# EAGLE design PiBladeBackPlane-V1 (EAGLE 7.4.0)

## Sheet 1 of 2
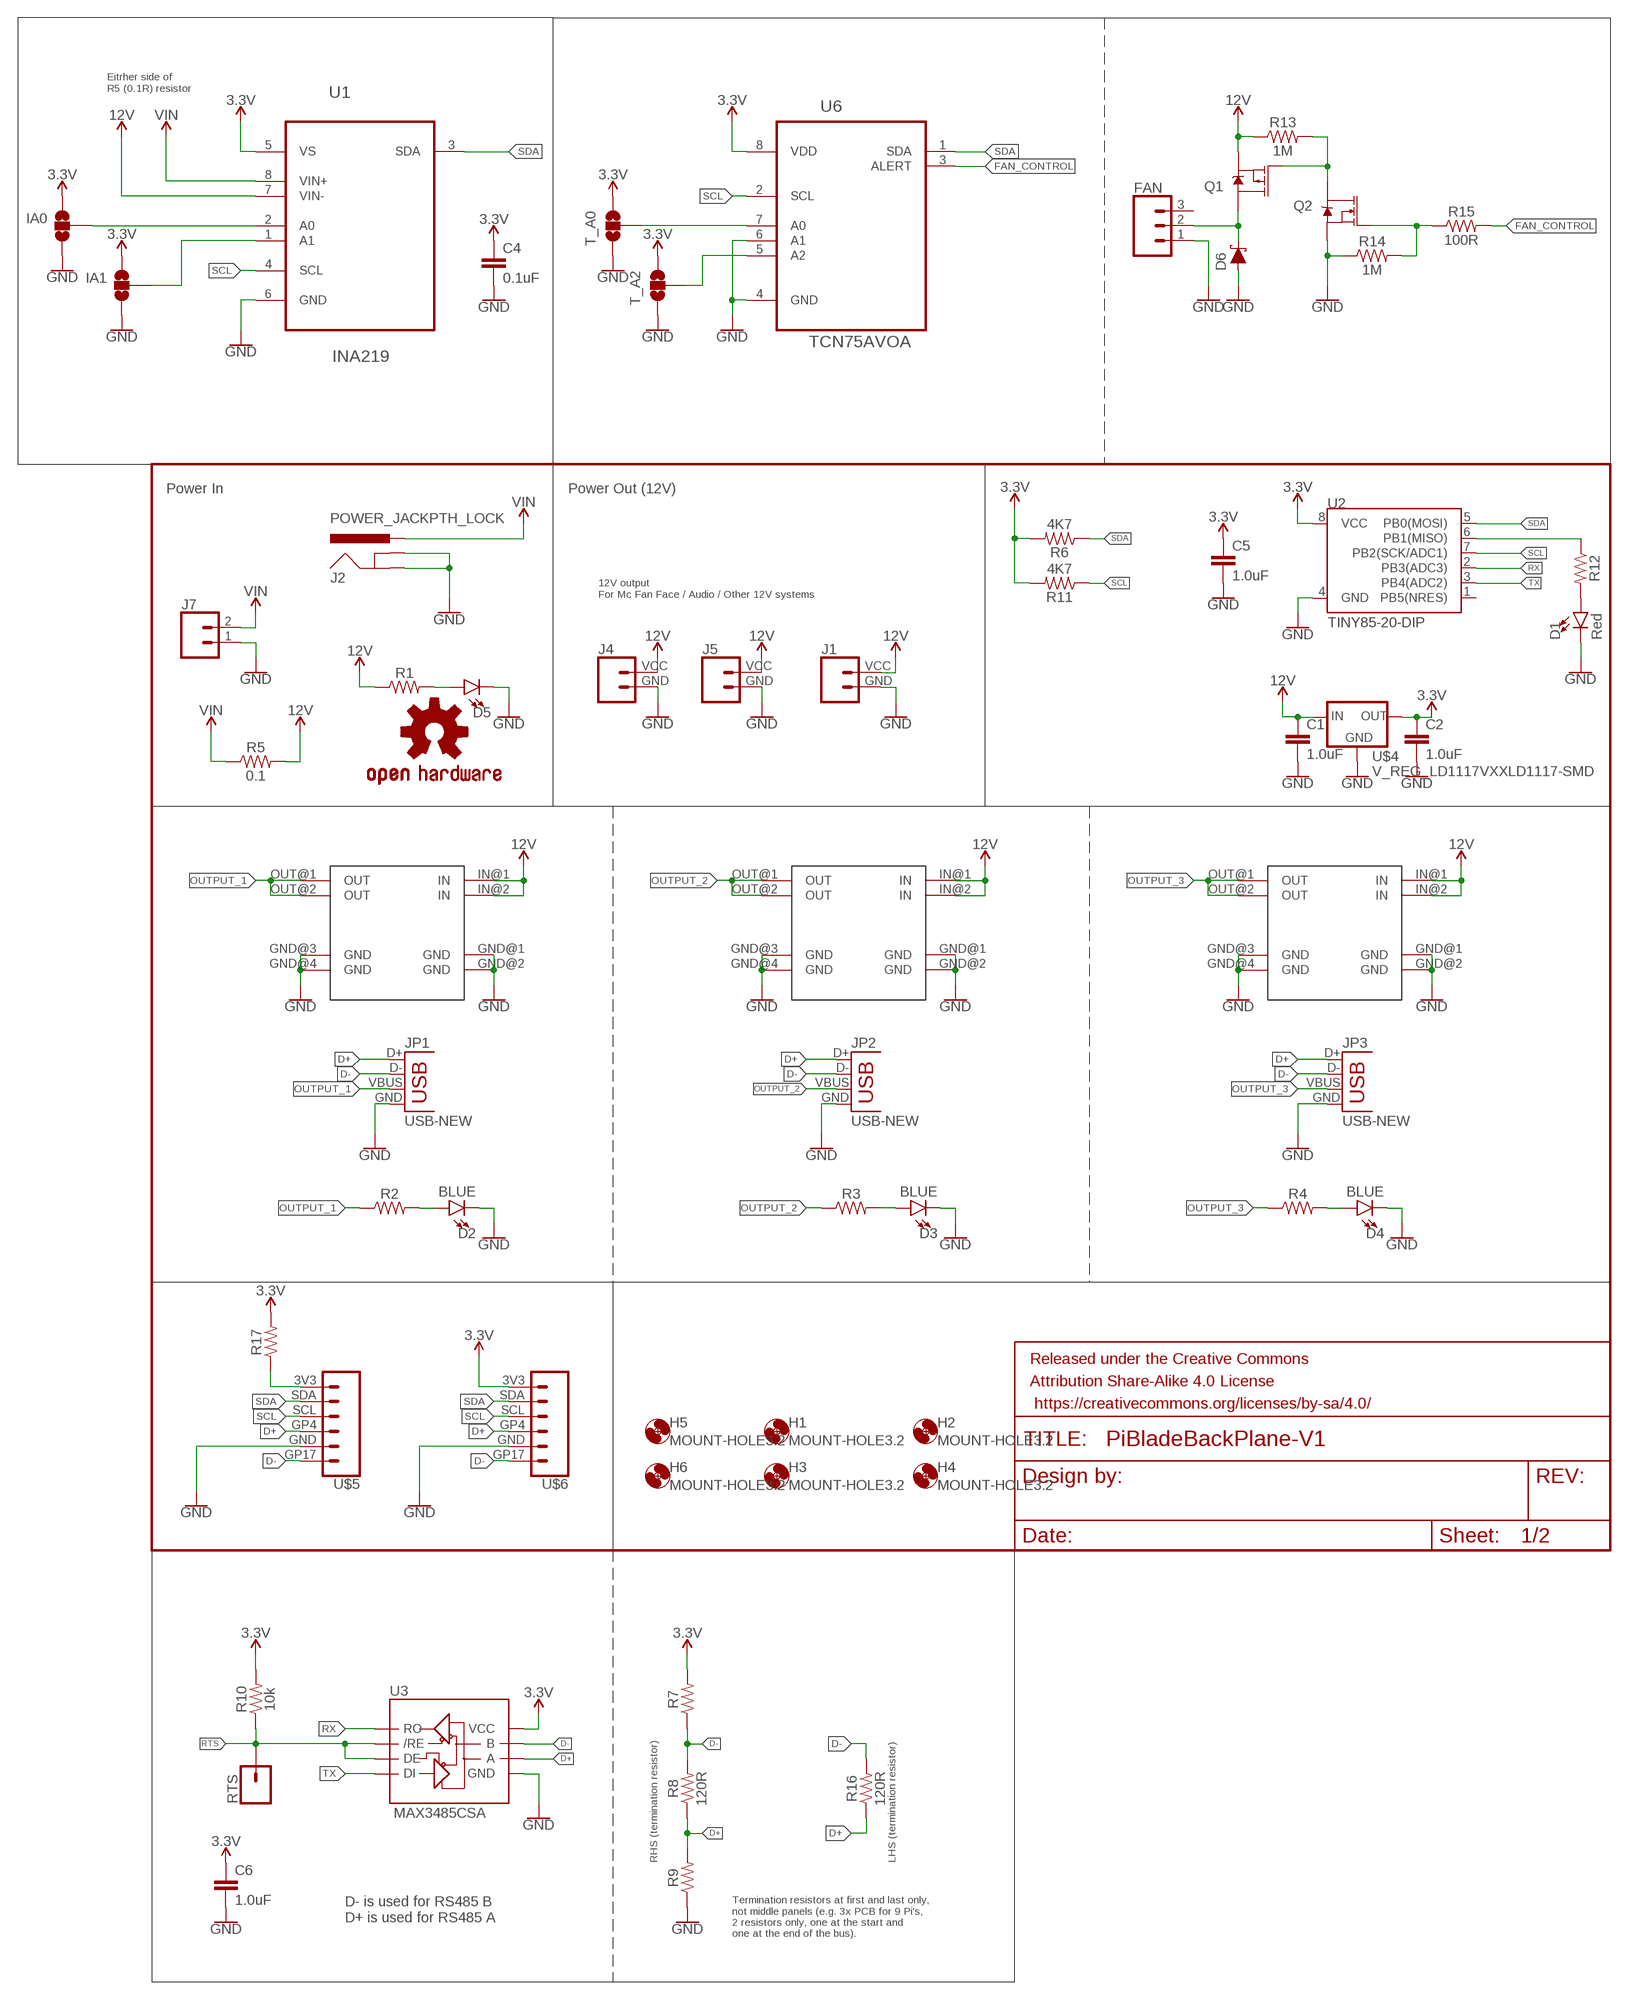
[diagram p0: schematic, sheet 1]

### Parts
C1  1.0uF  1.0UF-0805-25V-(+80/-20%)  [0805]
C2  1.0uF  1.0UF-0805-25V-(+80/-20%)  [0805]
C4  0.1uF  1.0UF-0805-25V-(+80/-20%)  [0805]
C5  1.0uF  1.0UF-0805-25V-(+80/-20%)  [0805]
C6  1.0uF  1.0UF-0805-25V-(+80/-20%)  [0805]
D1  Red  LED-BLUE1206  [LED-1206]
D2  BLUE  LED-BLUE1206  [LED-1206]
D3  BLUE  LED-BLUE1206  [LED-1206]
D4  BLUE  LED-BLUE1206  [LED-1206]
D5  LED1206-BOTTOM  [LED-1206-BOTTOM]
D6  1A/23V/620mV  DIODE-SCHOTTKY-BAT20J  [SOD-323]
FAN  CONN_03POLAR  [MOLEX-1X3]
FRAME1  FRAME-LETTER  [CREATIVE_COMMONS]
H1  MOUNT-HOLE3.2  [3,2]
H2  MOUNT-HOLE3.2  [3,2]
H3  MOUNT-HOLE3.2  [3,2]
H4  MOUNT-HOLE3.2  [3,2]
H5  MOUNT-HOLE3.2  [3,2]
H6  MOUNT-HOLE3.2  [3,2]
IA0  JUMPER-SMT_3_NO_NO_SILK  [SMT-JUMPER_3_0-NO_TRACE_NO-SILK]
IA1  JUMPER-SMT_3_NO_NO_SILK  [SMT-JUMPER_3_0-NO_TRACE_NO-SILK]
J1  CONN_02JST-2-PH-VERT  [JST-2-SMD-VERT]
J2  POWER_JACKPTH_LOCK  [POWER_JACK_PTH_LOCK]
J4  CONN_02JST-2-PH-VERT  [JST-2-SMD-VERT]
J5  CONN_02JST-2-PH-VERT  [JST-2-SMD-VERT]
J7  CONN_025MM  [SCREWTERMINAL-5MM-2]
JP1  USB-NEW  [USB-A-VERTICAL]
JP2  USB-NEW  [USB-A-VERTICAL]
JP3  USB-NEW  [USB-A-VERTICAL]
LOGO1  OSHW-LOGOM  [OSHW-LOGO-M]
Q1  4.3A/20V/54mΩ  MOSFET_PCH-IRLML2244  [SOT23-3]
Q2  310mA/60V/1.6Ω  MOSFET-NCH-2N7002PW  [SOT323]
R1  RESISTOR0805  [0805]
R2  RESISTOR0805  [0805]
R3  RESISTOR0805  [0805]
R4  RESISTOR0805  [0805]
R5  0.1  0.1OHM-1210-1/2W-1%  [1210]
R6  4K7  RESISTOR0805  [0805]
R7  RESISTOR0805  [0805]
R8  120R  RESISTOR0805  [0805]
R9  RESISTOR0805  [0805]
R10  10k  RESISTOR0805  [0805]
R11  4K7  RESISTOR0805  [0805]
R12  RESISTOR0805  [0805]
R13  1M  RESISTOR0805  [0805]
R14  1M  RESISTOR0805  [0805]
R15  100R  RESISTOR0805  [0805]
R16  120R  RESISTOR0805  [0805]
R17  RESISTOR1206  [1206]
RTS  CONN_01  [1X01]
T_A0  JUMPER-SMT_3_NO_NO_SILK  [SMT-JUMPER_3_0-NO_TRACE_NO-SILK]
T_A2  JUMPER-SMT_3_NO_NO_SILK  [SMT-JUMPER_3_0-NO_TRACE_NO-SILK]
U1  INA219  INA219AIDCNRSOIC  [SO08]
U2  TINY85-20-DIP  ATTINY45TINY85-20-DIP  [DIP08_MCU]
U3  MAX3485CSA  RS485SOIC  [SO08]
U6  TCN75AVOA  [SOIC127P600X175-8N]
U$1  MINI-BUCK-MODULE-3A  [MINI-BUCK-MODULE-3A]
U$2  MINI-BUCK-MODULE-3A  [MINI-BUCK-MODULE-3A]
U$3  MINI-BUCK-MODULE-3A  [MINI-BUCK-MODULE-3A]
U$4  V_REG_LD1117VXXLD1117-SMD  [SOT223]
U$5  MC_PI_FACE_CONNECTORS_I2CTOP  [JST-6-SH-1.0MM-TOP]
U$6  MC_PI_FACE_CONNECTORS_I2CTOP  [JST-6-SH-1.0MM-TOP]

### Nets
3.3V: C2.1 C4.1 C5.1 C6.1 IA0.1 IA1.1 R6.2 R7.2 R10.2 R11.2 R17.2 T_A0.1 T_A2.1 U1.5(VS) U2.8(VCC) U3.8(VCC) U6.8(VDD) U$4.2(OUT) U$6.3V3
12V: C1.1 J1.VCC J4.VCC J5.VCC Q1.2(S) R1.1 R5.2 R13.1 U1.7(VIN-) U$1.IN@1(IN) U$1.IN@2(IN) U$2.IN@1(IN) U$2.IN@2(IN) U$3.IN@1(IN) U$3.IN@2(IN) U$4.3(IN)
A0: IA0.2 U1.2(A0)
A1: IA1.2 U1.1(A1)
D+: JP1.D+ JP2.D+ JP3.D+ R8.1 R9.2 R16.1 U3.6(A) U$5.GP4 U$6.GP4
D-: JP1.D- JP2.D- JP3.D- R7.1 R8.2 R16.2 U3.7(B) U$5.GP17 U$6.GP17
FAN_CONTROL: R15.2 U6.3(ALERT)
GND: C1.2 C2.2 C4.2 C5.2 C6.2 D1.C D2.C D3.C D4.C D5.C D6.A FAN.1 IA0.3 IA1.3 J1.GND J2.GND J2.GNDBREAK J4.GND J5.GND J7.1 JP1.GND JP2.GND JP3.GND Q2.2(S) R9.1 R14.1 T_A0.3 T_A2.3 U1.6(GND) U2.4(GND) U3.5(GND) U6.4(GND) U6.6(A1) U$1.GND@1(GND) U$1.GND@2(GND) U$1.GND@3(GND) U$1.GND@4(GND) U$2.GND@1(GND) U$2.GND@2(GND) U$2.GND@3(GND) U$2.GND@4(GND) U$3.GND@1(GND) U$3.GND@2(GND) U$3.GND@3(GND) U$3.GND@4(GND) U$4.1(GND) U$5.GND U$6.GND
N$1: D5.A R1.2
N$3: D4.A R4.2
N$4: D2.A R2.2
N$6: D1.A R12.2
N$7: D3.A R3.2
N$8: R12.1 U2.6(PB1(MISO))
N$9: Q1.1(G) Q2.3(D) R13.2
N$10: D6.C FAN.2 Q1.3(D)
N$11: T_A0.2 U6.7(A0)
N$12: T_A2.2 U6.5(A2)
N$18: Q2.1(G) R14.2 R15.1
N$25: R17.1 U$5.3V3
OUTPUT_1: JP1.VBUS R2.1 U$1.OUT@1(OUT) U$1.OUT@2(OUT)
OUTPUT_2: JP2.VBUS R3.1 U$2.OUT@1(OUT) U$2.OUT@2(OUT)
OUTPUT_3: JP3.VBUS R4.1 U$3.OUT@1(OUT) U$3.OUT@2(OUT)
RTS: R10.1 RTS.1 U3.2(/RE) U3.3(DE)
RX: U2.2(PB3(ADC3)) U3.1(RO)
SCL: R11.1 U1.4(SCL) U2.7(PB2(SCK/ADC1)) U6.2(SCL) U$5.SCL U$6.SCL
SDA: R6.1 U1.3(SDA) U2.5(PB0(MOSI)) U6.1(SDA) U$5.SDA U$6.SDA
TX: U2.3(PB4(ADC2)) U3.4(DI)
VIN: J2.PWR J7.2 R5.1 U1.8(VIN+)
Unconnected: FAN.3 U2.1(PB5(NRES))

### Notes on the sheet
- Eitrher side of 
  R5 (0.1R) resistor
- Power In | Power Out (12V)
- 12V output
  For Mc Fan Face / Audio / Other 12V systems
- RHS (termination resistor) | LHS (termination resistor)
- D- is used for RS485 B
  D+ is used for RS485 A
- Termination resistors at first and last only, 
  not middle panels (e.g. 3x PCB for 9 Pi's, 
  2 resistors only, one at the start and 
  one at the end of the bus).

## Sheet 2 of 2

## Library data of the parts
C1 C2 C5 C6 = SparkFun-Capacitors:1.0UF: 1µF ceramic capacitors A capacitor is a passive two-terminal electrical component used to store electrical energy temporarily in an electric field.; PROD_ID: CAP-11625
C4 = SparkFun-Capacitors:1.0UF: 1µF ceramic capacitors A capacitor is a passive two-terminal electrical component used to store electrical energy temporarily in an electric field.; PROD_ID: CAP-11625; VALUE: 1.0uF
D1 = SparkFun-LED:LED-BLUE: Blue SMD LED Used in manufacturing of various products at SparkFun Packages: 0603 - SMD 0603 package [Product Link] <http://www.digikey.com/product-detail/en/SMLE12BC7TT86/511-1589-2-ND/1641808> 1206 - SMD1206 package [Product Link] <http://www.digikey.com/product-detail/en/lite-on-inc/LTST-C150TBKT/160-1643-1-ND/573584> SparkFun Products: ESP8266 Thing-Dev Board <https://www.sparkfun.com/products/13711> RedBoard <https://www.sparkfun.com/products/12757>; PROD_ID: DIO-09911; VALUE: BLUE
D2-D4 = SparkFun-LED:LED-BLUE: Blue SMD LED Used in manufacturing of various products at SparkFun Packages: 0603 - SMD 0603 package [Product Link] <http://www.digikey.com/product-detail/en/SMLE12BC7TT86/511-1589-2-ND/1641808> 1206 - SMD1206 package [Product Link] <http://www.digikey.com/product-detail/en/lite-on-inc/LTST-C150TBKT/160-1643-1-ND/573584> SparkFun Products: ESP8266 Thing-Dev Board <https://www.sparkfun.com/products/13711> RedBoard <https://www.sparkfun.com/products/12757>; PROD_ID: DIO-09911
D5 = SparkFun-LED:LED: LED (Generic) Standard schematic elements and footprints for 5mm, 3mm, 1206, and 0603 sized LEDs. Generic LEDs with no color specified.
D6 = SparkFun-DiscreteSemi:DIODE-SCHOTTKY: Schottky diode A Schottky diode is a semiconductor diode which has a low forward voltage drop and a very fast switching action.; PROD_ID: DIO-11623
FAN = SparkFun-Connectors:CONN_03: Multi connection point. Often used as Generic Header-pin footprint for 0.1 inch spaced/style header connections On any of the 0.1 inch spaced packages, you can populate with these: Break Away Headers - Straight <https://www.sparkfun.com/products/116> (PRT-00116) Break Away Male Headers - Right Angle <https://www.sparkfun.com/products/553> (PRT-00553) Female Headers <https://www.sparkfun.com/products/115> (PRT-00115) Break Away Headers - Machine Pin <https://www.sparkfun.com/products/117> (PRT-00117) Break Away Female Headers - Swiss Machine Pin <https://www.sparkfun.com/products/743> (PRT-00743) Stackable Header - 3 Pin (Female, 0.1") <https://www.sparkfun.com/products/13875> (PRT-13875) For SCREWTERMINALS and SPRING TERMINALS visit here: Screw Terimnals on SparkFun.com <https://www.sparkfun.com/search/results?term=Screw+Terminals> (5mm/3.5mm/2.54mm spacing) This device is also useful as a general connection point to wire up your design to another part of your project. Our various solder wires solder well into these plated through hole pads. Hook-Up Wire - Assortment (Stranded, 22 AWG) <https://www.sparkfun.com/products/11375> (PRT-11375) Hook-Up Wire - Assortment (Solid Core, 22 AWG) <https://www.sparkfun.com/products/11367> (PRT-11367) View the entire wire category on our website here <https://www.sparkfun.com/categories/141> Special notes: Molex polarized connector foot print use with SKU : PRT-08232 with associated crimp pins and housings.; PROD_ID: CONN-08625; SF_ID: PRT-08096
FRAME1 = SparkFun-Aesthetics:FRAME-LETTER: Schematic Frame - Letter Standard 8.5x11 US Letter frame
H1-H6 = holes:MOUNT-HOLE: MOUNTING HOLE with drill center marker
IA0 IA1 T_A0 T_A2 = SparkFun-Jumpers:JUMPER-SMT_3_NO: Normally open jumper This jumper has three pads in close proximity to each other. Apply solder to close the connection(s).
J1 J4 J5 = ThingySticks:CONN_02: Multi connection point. Often used as Generic Header-pin footprint for 0.1 inch spaced/style header connections On any of the 0.1 inch spaced packages, you can populate with these: Break Away Headers - Straight <https://www.sparkfun.com/products/116> (PRT-00116) Break Away Male Headers - Right Angle <https://www.sparkfun.com/products/553> (PRT-00553) Female Headers <https://www.sparkfun.com/products/115> (PRT-00115) Break Away Headers - Machine Pin <https://www.sparkfun.com/products/117> (PRT-00117) Break Away Female Headers - Swiss Machine Pin <https://www.sparkfun.com/products/743> (PRT-00743) For SCREWTERMINALS and SPRING TERMINALS visit here: Screw Terimnals on SparkFun.com <https://www.sparkfun.com/search/results?term=Screw+Terminals> (5mm/3.5mm/2.54mm spacing) This device is also useful as a general connection point to wire up your design to another part of your project. Our various solder wires solder well into these plated through hole pads. Hook-Up Wire - Assortment (Stranded, 22 AWG) <https://www.sparkfun.com/products/11375> (PRT-11375) Hook-Up Wire - Assortment (Solid Core, 22 AWG) <https://www.sparkfun.com/products/11367> (PRT-11367) View the entire wire category on our website here <https://www.sparkfun.com/categories/141> Special notes: Molex polarized connector foot print use with: PRT-08233 with associated crimp pins and housings. 2.54_SCREWTERM for use with PRT-10571. 3.5mm Screw Terminal footprints for PRT-08084 5mm Screw Terminal footprints for use with PRT-08432
J2 = SparkFun-Connectors:POWER_JACK: Power Jack Connector This is the standard 5.5mm barrel jack for power. The PTH is the most common, proven, reliable, footprint. The Slot footprint only works if the mill layer is transmitted to the PCB fab house so be warned. Here are the connectors we sell at SparkFun: DC Barrel Power Jack/Connector <https://www.sparkfun.com/products/119> (PRT-00119) DC Barrel Power Jack/Connector (SMD) <https://www.sparkfun.com/products/12748> (PRT-12748) DC Barrel Jack Adapter - Breadboard Compatible <https://www.sparkfun.com/products/10811> (PRT-10811) It is used on this SparkFun product (and many, many others): SparkFun RedBoard - Programmed with Arduino <https://www.sparkfun.com/products/12757> (DEV-12757) Also, if you need a mating power supply or connector, please check these out: Wall Adapter Power Supply - 9VDC 650mA <https://www.sparkfun.com/products/298> (TOL-00298) DC Barrel Jack Adapter - Male <https://www.sparkfun.com/products/10287> (PRT-10287); PROD_ID: CONN-08197; SF_ID: PRT-00119
J7 = SparkFun-Connectors:CONN_02: Multi connection point. Often used as Generic Header-pin footprint for 0.1 inch spaced/style header connections On any of the 0.1 inch spaced packages, you can populate with these: Break Away Headers - Straight <https://www.sparkfun.com/products/116> (PRT-00116) Break Away Male Headers - Right Angle <https://www.sparkfun.com/products/553> (PRT-00553) Female Headers <https://www.sparkfun.com/products/115> (PRT-00115) Break Away Headers - Machine Pin <https://www.sparkfun.com/products/117> (PRT-00117) Break Away Female Headers - Swiss Machine Pin <https://www.sparkfun.com/products/743> (PRT-00743) For SCREWTERMINALS and SPRING TERMINALS visit here: Screw Terimnals on SparkFun.com <https://www.sparkfun.com/search/results?term=Screw+Terminals> (5mm/3.5mm/2.54mm spacing) This device is also useful as a general connection point to wire up your design to another part of your project. Our various solder wires solder well into these plated through hole pads. Hook-Up Wire - Assortment (Stranded, 22 AWG) <https://www.sparkfun.com/products/11375> (PRT-11375) Hook-Up Wire - Assortment (Solid Core, 22 AWG) <https://www.sparkfun.com/products/11367> (PRT-11367) View the entire wire category on our website here <https://www.sparkfun.com/categories/141> Special notes: Molex polarized connector foot print use with: PRT-08233 with associated crimp pins and housings. 2.54_SCREWTERM for use with PRT-10571. 3.5mm Screw Terminal footprints for PRT-08084 5mm Screw Terminal footprints for use with PRT-08432; SF_SKU: PRT-08432
JP1-JP3 = Tinamous:USB-NEW: USB Connectors USB-B-PTH is fully proven SKU : PRT-00139/CONN-08278 USB-miniB is fully proven SKU : PRT-00587 USB-A-PCB is untested. USB-A-H is throughly reviewed, but untested. Spark Fun Electronics SKU : PRT-00437 USB-B-SMT is throughly reviewed, but untested. Needs silkscreen touching up. USB-A-S has not been used/tested USB-MB-H has not been used/tested USB-MICROB has been used. CONN-09505
LOGO1 = SparkFun-Aesthetics:OSHW-LOGO: Open-Source Hardware (OSHW) Logo This logo indicates the piece of hardware it is found on incorporates a OSHW license and/or adheres to the definition of open source hardware found here: http://freedomdefined.org/OSHW
Q1 = SparkFun-DiscreteSemi:MOSFET_PCH: P-channel MOSFETs Voltage controlled devices that allow control of high current outputs. SparkFun Products: SparkFun ESP32 Thing <https://www.sparkfun.com/products/13907> SparkFun ESP8266 Thing <https://www.sparkfun.com/products/13231>; PROD_ID: TRANS-11153
Q2 = SparkFun-DiscreteSemi:MOSFET-NCH: N-channel MOSFETs Voltage controlled devices that allow control of high current outputs. SparkFun Products: SparkFun OpenScale <https://www.sparkfun.com/products/13261> SparkFun Digital Sandbox <https://www.sparkfun.com/products/12651> SparkFun Monster Moto Shield <https://www.sparkfun.com/products/10182> SparkFun MOSFET Power Controller <https://www.sparkfun.com/products/11214>; PROD_ID: TRANS-11151
R1-R4 R6-R17 = SparkFun-Resistors:RESISTOR: Generic Resistor Package
R5 = SparkFun-Resistors:0.1OHM: 0.1Ω resistor A resistor is a passive two-terminal electrical component that implements electrical resistance as a circuit element. Resistors act to reduce current flow, and, at the same time, act to lower voltage levels within circuits. - Wikipedia; PROD_ID: RES-12374
RTS = SparkFun-Connectors:CONN_01: Single connection point. Often used as Generic Header-pin footprint for 0.1 inch spaced/style header connections On any of the 0.1 inch spaced packages, you can populate with these: Break Away Headers - Straight <https://www.sparkfun.com/products/116> (PRT-00116) Break Away Male Headers - Right Angle <https://www.sparkfun.com/products/553> (PRT-00553) Female Headers <https://www.sparkfun.com/products/115> (PRT-00115) Break Away Headers - Machine Pin <https://www.sparkfun.com/products/117> (PRT-00117) Break Away Female Headers - Swiss Machine Pin <https://www.sparkfun.com/products/743> (PRT-00743) This device is also useful as a general connection point to wire up your design to another part of your project. Our various solder wires solder well into these plated through hole pads. Hook-Up Wire - Assortment (Stranded, 22 AWG) <https://www.sparkfun.com/products/11375> (PRT-11375) Hook-Up Wire - Assortment (Solid Core, 22 AWG) <https://www.sparkfun.com/products/11367> (PRT-11367) View the entire wire category on our website here <https://www.sparkfun.com/categories/141> Special notes: SMTSO-256-ET is a "flush mount" nut for a 4-40 screw. We mostly use this on specialty testbeds; it is a nice way to connect hardware to your PCB at an adjustable hieght. Also note, the SNAP packages are for using a snappable style connector. We sell a baggie of snaps and they are also used on two LilyPad designs: Snap Assortment - 30 pack (male and female) <https://www.sparkfun.com/products/11347> (DEV-11347) LilyPad Arduino SimpleSnap <https://www.sparkfun.com/products/10941> (DEV-10941) LilyPad SimpleSnap Protoboard <https://www.sparkfun.com/products/10940> (DEV-10940)
U1 = INA219AIDCNR:INA219AIDCNR: CURRENT/POWER MONITOR
U2 = SparkFun-Retired:ATTINY45: Atmel 8-pin 2/4/8kB flash uC Retired; PROD_ID: IC-09445
U3 = SparkFun-IC-Comms:RS485: RS-485 Transceiver SP3485 Series 8 Pin NSOIC 3.3 V Low Power Half Duplex RS-485 Transceiver MAX3485 compatible Datasheet <http://www.sparkfun.com/datasheets/Components/General/sp3485CN-LTR.pdf> SparkFun Products SparkFun Transceiver Breakout - RS-485 <https://www.sparkfun.com/products/10124> (BOB-10124) SparkFun USB to RS-485 Converter <https://www.sparkfun.com/products/9822> (BOB-09822); PROD_ID: IC-09388
U6 = Microchip-TCN75AVOA:TCN75AVOA: 2-Wire Serial Temperature Sensor,SOIC-8; MPN: TCN75AVOA; OC_FARNELL: 1605585; OC_NEWARK: 71J7900; PACKAGE: SOIC-8; SUPPLIER: MICROCHIP
U$1-U$3 = Tinamous:MINI-BUCK-MODULE-3A
U$4 = SparkFun-IC-Power:V_REG_LD1117VXX: LD1117VXX voltage regulator. We carry the 3.3V version (COM-00526) in TO-220 package.; PROD_ID: VREG-13917
U$5 U$6 = McPiFace:MC_PI_FACE_CONNECTORS_I2C

## Board
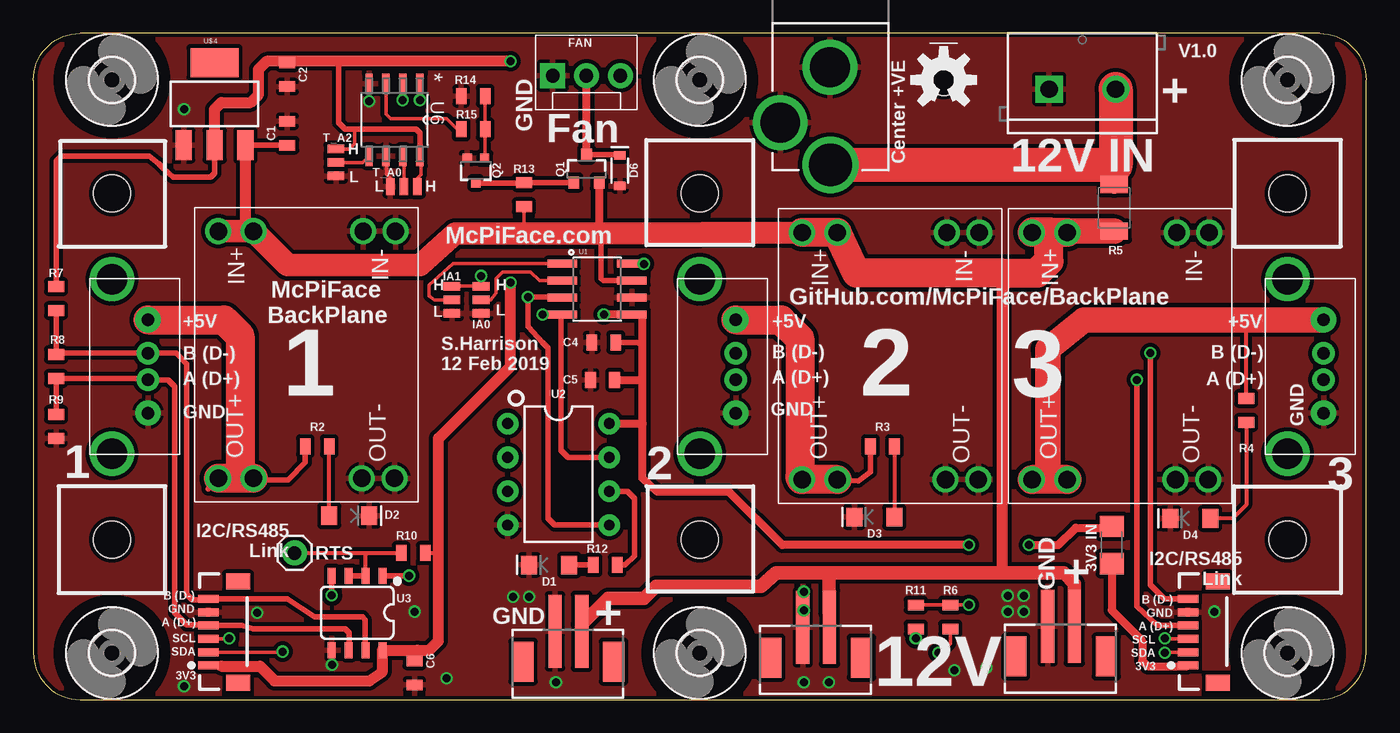
[diagram p1: board, top side]
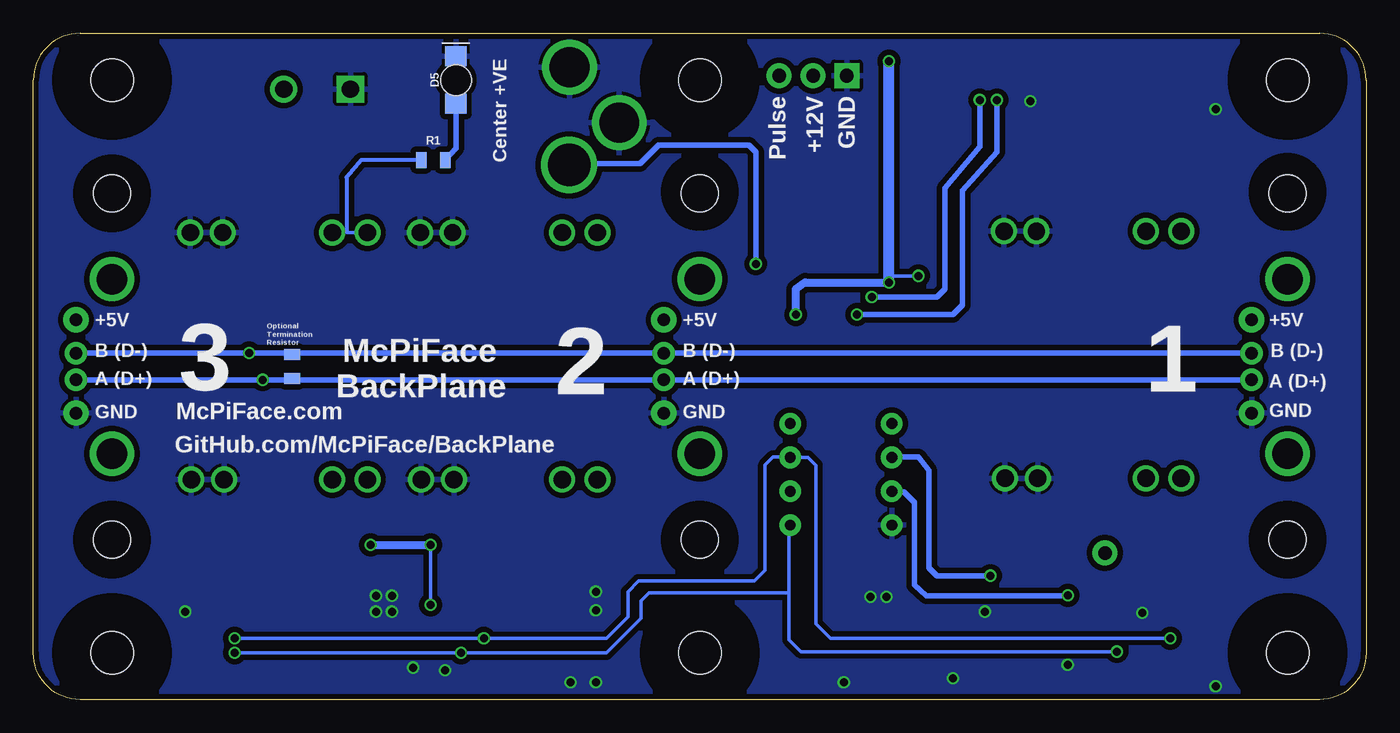
[diagram p2: board, bottom side, seen from below]

Size 100 x 50 mm. Coordinates in mm from the lower left corner, seen from the top.
Outline: 3.5,0 96.5,0 arc90 100,3.5 100,46.5 arc90 96.5,50 3.5,50 arc90 0,46.5 0,3.5 arc90 3.5,0
Copper layers (1*16): Top 0.035mm / dielectric 1.5mm / Bottom 0.035mm
Design rules "dirt_cheap_dirty_boards.v1.1": minimum track width 6mil, minimum drill 12mil, track to track 6mil, track to pad 6mil, pad to pad 6mil, via to via 6mil, smd to smd 0mil, copper to edge 10mil, drill to drill 10mil, minimum pad ring 10mil, minimum via ring 6mil, stop-mask expansion 2mil, vias tented up to drill 25mil, thermal gap 10mil
Holes 2.8 mm at 5.9,38 5.9,12 50,38 50,12 94.1,38 94.1,12
tKeepout: area 1.9,34 to 9.9,42; area 1.9,8 to 9.9,16; area 46,8 to 54,16; area 46,34 to 54,42; area 90.1,34 to 98.1,42; area 90.1,8 to 98.1,16
bRestrict: area 3.4,35.6 to 8.4,40.6; area 3.4,9.5 to 8.4,14.5; area 47.5,9.5 to 52.5,14.5; area 47.5,35.6 to 52.5,40.6; area 91.6,35.5 to 96.6,40.5; area 91.6,9.5 to 96.6,14.5

### Footprints (pad centres in the part's own frame; a part is rotated, then mirrored left to right if it is on the bottom)
0805 = smd 0.8 x 1.2: 1 -0.9,0; 2 0.9,0
LED-1206 = smd 1.2 x 1.4: A -1.5,0; C 1.5,0
LED-1206-BOTTOM = smd 1.5 x 1.6: A -1.8,0; C 1.8,0 | hole 2.3: 0,0
SOD-323 = smd 0.63 x 0.83: A 1.15,0; C -1.15,0
MOLEX-1X3 = drill 1.016 pad 1.88 square: 1 0,0 | drill 1.016 pad 1.88: 2 2.54,0; 3 5.08,0
3,2 = hole 3.2: 0,0
SMT-JUMPER_3_0-NO_TRACE_NO-SILK = smd 0.635 x 1.27: 1 -1.016,0; 2 0,0; 3 1.016,0
JST-2-SMD-VERT = smd 1 x 5.5: GND 1,-2; VCC -1,-2 | smd 1.6 x 3: P$1 -3.4,0.27; P$2 3.4,0.27
POWER_JACK_PTH_LOCK = drill 2.997 pad 4.115: GND 0.025,6.557; GNDBREAK 3.762,10.7 | drill 3.2 pad 4.115: PWR 0,13.878
SCREWTERMINAL-5MM-2 = drill 1.3 pad 2.032 square: 1 0,0 | drill 1.3 pad 2.032: 2 5,0
USB-A-VERTICAL = drill 0.95 pad 1.676: D+ 2.7,1; D- 2.7,-1 | drill 0.95 pad 1.88: GND 2.7,3.5; VBUS 2.7,-3.5 | drill 2.3: SHLD1 0,-6.55; SHLD2 0,6.55
SOT23-3 = smd 0.8 x 0.9: 1 -0.95,-1; 2 0.95,-1; 3 0,1.1
SOT323 = smd 0.7 x 0.7: 1 -0.65,-0.925; 2 0.65,-0.925; 3 0,0.925
1210 = smd 1.27 x 2.06: 1 -1.755,0; 2 1.755,0
1206 = smd 1.6 x 1.8: 1 -1.4,0; 2 1.4,0
1X01 = drill 1.016 pad 1.88: 1 0,0
SO08 = smd 0.61 x 2.21: 1 -1.905,-2.616; 2 -0.635,-2.616; 3 0.635,-2.616; 4 1.905,-2.616; 5 1.905,2.616; 6 0.635,2.616; 7 -0.635,2.616; 8 -1.905,2.616
DIP08_MCU = drill 0.813 pad 1.626: 1 -3.81,-3.81; 2 -1.27,-3.81; 3 1.27,-3.81; 4 3.81,-3.81; 5 3.81,3.81; 6 1.27,3.81; 7 -1.27,3.81; 8 -3.81,3.81
SO08' = smd 0.6 x 1.2: 1 -1.905,-2.8; 2 -0.635,-2.8; 3 0.635,-2.8; 4 1.905,-2.8; 5 1.905,2.8; 6 0.635,2.8; 7 -0.635,2.8; 8 -1.905,2.8
SOIC127P600X175-8N = smd 1.473 x 0.559: 1 -2.718,1.905; 2 -2.718,0.635; 3 -2.718,-0.635; 4 -2.718,-1.905; 5 2.718,-1.905; 6 2.718,-0.635; 7 2.718,0.635; 8 2.718,1.905
MINI-BUCK-MODULE-3A = drill 1.3: GND@1 20.32,4.13; GND@2 20.32,1.7; GND@3 1.778,4.228; GND@4 1.778,1.778; IN@1 20.32,14.986; IN@2 20.32,12.356; OUT@1 1.778,14.986; OUT@2 1.778,12.356
SOT223 = smd 1.219 x 2.235: 1 -2.311,-3.099; 2 0,-3.099; 3 2.311,-3.099 | smd 3.6 x 2.2: 4 0,3.099
JST-6-SH-1.0MM-TOP = smd 0.6 x 1.55: 3V3 -2.54,1.27; GND 1.46,1.27; GP4 0.46,1.27; GP17 2.46,1.27; SCL -0.54,1.27; SDA -1.54,1.27 | smd 1.2 x 1.8: P$1 -3.84,-0.955; P$2 3.76,-0.955

### Placement (x,y rotation side)
C1  19.05,42.5 90 top
C2  19.05,46.9 270 top
C4  42.8,26.8 180 top
C5  42.7,24 180 top
C6  28.6,2 270 top
D1  38.7,10.1 180 top
D2  23.7,13.8 0 top
D3  63.1,13.7 180 top
D4  86.8,13.6 180 top
D5  68.3,46.5 90 bottom
D6  44,39.7 270 top
FAN  38.96,46.82 0 top
FRAME1  -7.6,-30 0 top  (outside the outline)
H1  5.9,46.5 0 top
H2  5.9,3.5 0 top
H3  94.1,46.5 0 top
H4  94.1,3.5 0 top
H5  50,46.5 0 top
H6  50,3.5 0 top
IA0  33.6,30 270 top
IA1  31.4,30 270 top
J1  77.1,3.5 180 top
J2  59.8,54 180 top
J4  40.14,3.12 180 top
J5  58.73,3.42 180 top
J7  76.21,45.81 0 top
JP1  5.9,25 180 bottom
JP2  50,25 180 bottom
JP3  94.1,25 180 bottom
LOGO1  68.3,46.5 0 top
Q1  41.5,39.8 0 top
Q2  33.2,39.7 180 top
R1  70,40.5 0 bottom
R2  21.3,19 0 top
R3  63.7,19 0 top
R4  91,21.7 270 top
R5  81.1,36.9 270 top
R6  68.8,6.2 90 top
R7  1.7,30.1 90 top
R8  1.7,25 90 top
R9  1.7,20.5 90 top
R10  28.5,11 0 top
R11  66.2,6.2 90 top
R12  42.9,10.1 180 top
R13  36.8,37.9 90 top
R14  33,45.3 0 top
R15  33,42.8 180 top
R16  80.6,25 90 bottom
R17  80.9,11.6 90 top
RTS  19.6,11 0 top
T_A0  27.8,38.5 180 top
T_A2  22.7,40.3 270 top
U1  42.3,30.8 270 top
U2  39.4,16.9 270 top
U3  MAX3485CSA  [SO08']  24.3,6.5 180 top
U6  27.1,43.5 270 top
U$1  28.87,14.83 90 top
U$2  72.67,14.73 90 top
U$3  89.92,14.73 90 top
U$4  13.6,44.7 0 top
U$5  87.9,5.1 90 top
U$6  14.4,5.1 90 top

### Tracks (layer width: path | path; a pad name or v marks a point on that pad's centre or on a via)
3.3V  (via drill 0.6)
  Top 0.254: R11.2 R6.2 v70.2,7.1 | 35.59,25.89 35.8,26.2 | IA1.1 IA0.1 v33.6,31.8 | T_A0.1 28.82,39.12 29.1,39.4 29.1,40.69 U6.8 | T_A2.1 23.72,41.32 24.1,41.7 24.1,42.8 | 43.7,28.8 43.8,28.89
  Top 0.305: R10.2 30.4,11
  Top 0.406: R7.2 1.7,40.4 2.1,40.8 8.7,40.8 9.4,40.2 9.8,39.8 10.5,39.2 13.3,39.2 13.6,39.5 U$4.2 | U1.5 arc90 U1.5 43.8,28.89 | v42.8,28.89 v42.8,28.9 | U$6.3V3 13.86,2.56 14.1,2.5 | U3.8 | C6.1 28.6,3.5 28.8,3.7 | U6.8 29,42.49 28.7,42.8 24.1,42.8 23.4,42.8 22.9,43.3 22.9,47.9 | C4.1 45.4,26.8 45.7,26.5
  Top 0.61: 43.8,28.89 v42.8,28.89 | 45.71,20.71 45.7,21.4 | 45.7,21.4 45.7,24.3 | 45.7,24.3 45.7,26.5 45.7,28.9 U1.5 | C5.1 45.6,24 45.7,24.3 | v74.7,11.6 76.9,11.6 78.2,12.9 80.8,12.9 R17.2 | v70.2,11.6 56.2,11.6 52.2,15.6 46.8,15.6 45.7,16.6 45.7,20.8 | 45.7,20.8 45.7,21.4 | U2.8 45.61,20.71 45.7,20.8
  Top 0.813: v35.8,47.9 22.9,47.9 19.05,47.9 | U$4.2 13.6,44.3 14.1,44.8 16.3,44.8 16.9,45.4 16.9,47.3 17.5,47.9 19.05,47.9 | 14.1,2.5 17,2.5 18.1,1.4 25.2,1.4 26.2,2.1 U3.8 | U3.8 28.8,3.7 29.7,3.7 30.4,4.4 30.4,11 30.4,19.6 35.8,25 35.8,26.2 v35.8,31.3 | C2.1 19.05,47.9
  Bottom 0.254: v70.2,7.1 v70.2,11.6 | v33.6,31.8 35.79,31.8 35.79,31.81
  Bottom 0.61: v42.8,28.9 42.8,30.8 42.1,31.3 v35.8,31.3 | v74.7,11.6 v70.2,11.6
  Bottom 0.813: v35.8,31.3 35.79,31.81 v35.8,47.9
12V
  Top 0.254: R13.1 36.8,35.05 37.3,34.95
  Top 0.406: 16.71,35.35 U$1.IN@2 | U1.7 42.77,31.43 42.6,31.6 42.6,34.95 | 42.45,35.1 41.4,34.95 | C1.1 U$4.3
  Top 0.61: Q1.2 42.45,35.1
  Top 0.813: J5.VCC 59.73,6.33 59.7,6.56 | 72.7,9.5 72.7,31.9 | J4.VCC 41.14,5.64 | U$4.3 15.88,41.6 15.88,35.15
  Top 1.016: J1.VCC 78.1,8.7 77.3,9.5 72.7,9.5 59.7,9.5 | 59.7,9.5 59.7,6.56 | 41.14,5.64 43.1,7.6 45.8,7.6 46.7,8.5 54.6,8.5 55.7,9.5 59.7,9.5
  Top 1.676: U$2.IN@1 42.6,34.95 41.4,34.95 37.3,34.95 31.65,34.95 29,32.6 19.06,32.6 U$1.IN@2 15.88,35.15 U$1.IN@1
  Top 1.93: R5.2 77.66,35.15 U$3.IN@2
  Top 2.184: 72.82,32 61.76,32 U$2.IN@2 U$2.IN@1 | 72.7,31.9 72.91,31.91 72.82,32 | 72.82,32 75.3,32 76.2,32.9 76.2,35 76.3,35.1 74.98,35.1 U$3.IN@1 U$3.IN@2
  Bottom 0.305: R1.1 75.4,40.5 76.5,39.2 76.5,35.08 U$3.IN@1
A0
  Top 0.254: U1.2 37.97,31.43 37.3,32.1 35.2,32.1 34.7,31.6 34.7,30.5 34.3,30 IA0.2
A1
  Top 0.254: U1.1 31.5,32.7 29.7,31.1 29.7,30.3 29.8,30.2 30.1,30 IA1.2
D+  (via drill 0.6)
  Top 0.406: JP3.D+ 96.5,24 | R9.2 R8.1 8.5,24.1 JP1.D+ 10.1,24 10.6,23.5 10.6,6.5 11.5,5.6 13.09,5.6 U$6.GP4 15.64,5.56 16.5,5.3 23.4,5.3 23.7,5 23.7,3.67 U3.6 | v82.8,24 82.8,7 84.34,5.56 U$5.GP4
  Bottom 0.254: R16.1 80.7,24.1 80.8,24
  Bottom 0.406: JP1.D+ JP2.D+ 80.8,24 v82.8,24 JP3.D+
D-  (via drill 0.6)
  Top 0.406: JP3.D- 96.6,26 | R7.1 R8.2 1.4,26 JP1.D- 10.7,26 11.5,25.2 11.5,7.9 11.9,7.5 13.07,7.5 U$6.GP17 19.04,7.56 21.1,6.2 24.7,6.2 24.9,6 24.9,3.73 U3.7 | v83.8,26 83.8,8.6 84.84,7.56 U$5.GP17
  Bottom 0.254: R16.2 81.2,25.9 81.3,26
  Bottom 0.406: JP1.D- JP2.D- 81.3,26 v83.8,26 JP3.D-
FAN_CONTROL
  Top 0.254: U6.3 26.46,43.94 26.8,43.6 31,43.6 31.8,42.8 R15.2
GND  (via drill 0.6)
  Top 0.254: T_A0.3 26.78,39.12 26.5,39.4 26.5,40.75 U6.6
  other vias: 22.4,2.6 57.8,6.7 59.7,1.3 57.8,1.3 57.8,8.1 74.3,7.8 74.3,6.6 73.1,6.6 73.1,7.8 16.8,6.5 37.2,7.7 36,7.7 39.2,1.3 31,1.6 11.3,1 88.6,6.6 69.1,2.2 71.5,2.4 28.6,6.6 11.3,44.3 25.2,44.9
  pour Top (isolate 0.305, rank 6): -1,50.8 100.6,50.8 100.7,-0.6 -0.9,-0.6 -0.9,32.4
  pour Bottom (isolate 0.406, rank 6): -2.2,51.6 102.3,51.6 102.3,-1.6 -2.2,-1.6
N$1
  Bottom 0.406: D5.A 68.3,41.4 R1.2
N$3
  Top 0.305: R4.2 91,14.6 90,13.6 D4.A
N$4
  Top 0.305: D2.A R2.2
N$6
  Top 0.406: R12.2 D1.A
N$7
  Top 0.305: R3.2 D3.A
N$8
  Top 0.406: U2.6 44.57,15.63 45.1,15.1 45.1,10.8 44.4,10.1 R12.1
N$9
  Top 0.406: Q1.1 R13.2 36.48,38.77 Q2.3
N$10
  Top 0.406: Q1.3 43.95,40.9 D6.C
  Top 0.61: Q1.3 FAN.2
N$11
  Top 0.254: T_A0.2 27.8,40.72 U6.7
N$12
  Top 0.254: T_A2.2 24.71,40.3 U6.5
N$18
  Top 0.254: Q2.1 33.9,40.67 R14.2 R15.1
N$25
  Top 0.61: R17.1 80.9,6.7 83.2,4.4 83.2,2.9 83.6,2.5 86.57,2.5 U$5.3V3
OUTPUT_1
  Top 0.406: R2.1 20.4,17.8 19.1,16.5 13.9,16.5 13.1,15.82 U$1.OUT@1
  Top 2.184: U$1.OUT@1 U$1.OUT@2 15.5,16.62 15.5,27.3 14.3,28.5 JP1.VBUS
OUTPUT_2
  Top 0.406: R3.1 62.8,17.1 61.9,16.4 58.1,16.61 57.6,16.51
  Top 2.184: U$2.OUT@2 U$2.OUT@1 57.6,16.51 57.5,16.71 57.5,27.1 56.1,28.5 JP2.VBUS
OUTPUT_3
  Top 0.305: R4.1 91,28.5
  Top 1.93: JP3.VBUS 91,28.5 78.8,28.5 76.1,26.3 76.1,16.54
  Top 2.184: U$3.OUT@1 U$3.OUT@2 76.1,16.54
RTS
  Top 0.305: RTS.1 25,11 | 25,11 R10.1 | U3.2 24.93,10.87 25,11
  Top 0.406: U3.2 U3.3
RX  (via drill 0.6)
  Top 0.406: U3.1 v28.2,9.3
  Bottom 0.406: v28.2,9.3 32.2,9.3 32.8,9.9 32.8,17.2 33.6,18.2 35.52,18.2 U2.2
SCL  (via drill 0.6)
  Top 0.254: U$6.SCL 14.66,4.56 v14.7,4.6 | U$5.SCL 85.16,4.56 v84.9,4.6 | R11.1 v66.2,4.6 | v27.7,45 27.7,46.18 U6.2
  Top 0.406: U2.7 40.13,18.17 39.6,18.7 39.6,28.81 U1.4 v38.2,28.89 v38.2,28.9
  Bottom 0.254: v84.9,4.6 v66.2,4.6 57,4.6 55.4,6.2 55.4,8.1 54.6,8.9 45.9,8.9 45.1,9.7 45.1,17.6 44.5,18.2 43.84,18.2 U2.7 41.9,18.17 41.3,17.57 41.3,5.7 40.2,4.6 v14.7,4.6
  Bottom 0.406: v38.2,28.9 31,28.9 30.3,29.6 30.3,38.2 27.7,41.1 v27.7,45
SDA  (via drill 0.6)
  Top 0.254: U$6.SDA 18.44,3.56 v18.7,3.6 | U$5.SDA 84.96,3.56 v84.9,3.5 | R6.1 68.8,4.2 68.1,3.5 v67.9,3.5 | v29,45 U6.1
  Top 0.406: U2.5 39.11,13.09 38.6,13.6 38.6,26.4 38.2,26.8 37.1,28 v37.1,30.2 39.65,30.2 U1.3
  Bottom 0.254: v18.7,3.6 42.4,3.6 43.3,4.5 43.3,8.1 | v84.9,3.5 v67.9,3.5 57,3.5 54.4,6.1 54.4,7.4 53.8,8 43.4,8 43.3,8.1 | 43.3,8.1 43.3,13
  Bottom 0.305: 43.3,13 U2.5
  Bottom 0.406: v29,45 29,41.5 31.6,38.4 31.6,30.8 32.2,30.2 v37.1,30.2
TX  (via drill 0.6)
  Top 0.406: U3.4 v22.39,7.8
  Bottom 0.406: v22.39,7.8 22.9,7.8 33,7.8 33.9,8.6 33.9,14.8 34.7,15.6 35.36,15.6 U2.3
VIN  (via drill 0.6)
  Top 0.406: U1.8 45.4,32.7 v45.8,32.7
  Top 1.422: 81.21,40.11 81.21,38.77 R5.1
  Top 2.54: J7.2 81.21,40.11 81.2,40.1 59.82,40.1 J2.PWR
  Bottom 0.406: v45.8,32.7 45.8,41.1 46.3,41.6 53.1,41.6 54.5,40.2 59.72,40.2 J2.PWR

### Text on the board
tNames: V1.0 | GND | + | Fan | H | Center +VE | 12V IN | L | L | H | McPiFace.com | McPiFace / BackPlane | H | H | GitHub.com/McPiFace/BackPlane | L | L | +5V | +5V | +5V | B (D-) | B (D-) | B (D-) | S.Harrison / 12 Feb 2019 | A (D+) | A (D+) | A (D+) | 1 | 2 | 3 | GND | GND | GND | 1 | 2 | 3 | I2C/RS485 / Link | GND | I2C/RS485 / Link | 3V3 IN | B (D-) | + | B (D-) | GND | GND | GND | A (D+) | A (D+) | SCL | + | SCL | SDA | SDA | 3V3 | 3V3 | 12V
bNames: GND | +12V | Pulse | Center +VE | +5V | +5V | +5V | McPiFace / BackPlane | Optional / Termination / Resistor | B (D-) | B (D-) | B (D-) | A (D+) | A (D+) | A (D+) | 1 | 2 | 3 | GND | GND | McPiFace.com | GND | GitHub.com/McPiFace/BackPlane